# Altium project HDT_9.PrjPcb
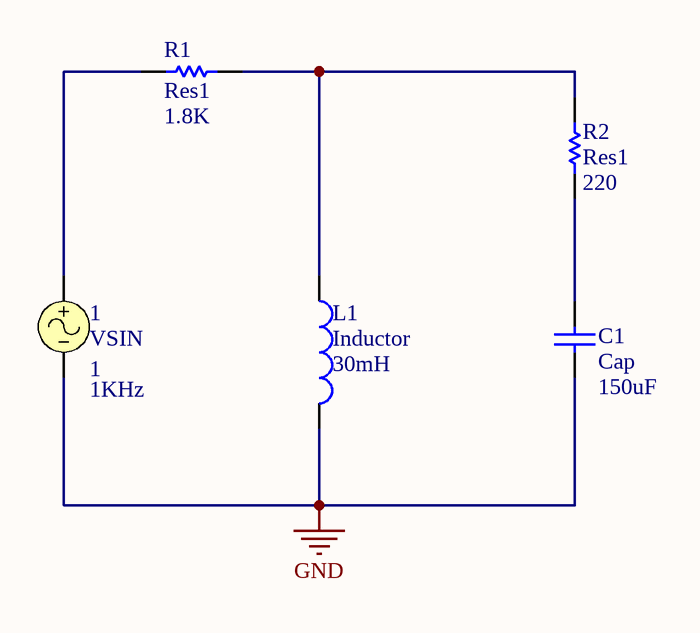
[diagram p0: Fourier.SchDoc]
6 sheets, 28 parts. Net scope: global (net labels, ports and power ports of the same name join across sheets).
Sheets:
  Fourier.SchDoc
  Montecarlo.SchDoc
  Ruido.SchDoc
  Polos y Ceros.SchDoc
  Worst case.SchDoc
  Barrido de temperatura.SchDoc

## Sheet Fourier.SchDoc
size A4

### Parts
1  VSIN  Amplitude: 1  Frequency: 1KHz
C1  Cap  value 150uF  [RAD-0.3]
L1  Inductor  value 30mH  [0402-A]
R1  Res1  value 1.8K  [AXIAL-0.3]
R2  Res1  value 220  [AXIAL-0.3]

### Nets
GND: 1.2 C1.1 L1.2
Net1_1: 1.1 R1.1
NetC1_2: C1.2 R2.2
NetL1_1: L1.1 R1.2 R2.1

### Library data of the parts
1 = VSIN: Sinusoidal Voltage Source; Note: PCB Footprint - Not required; Published: 8-Jun-2000; LatestRevisionDate: 15-Nov-2004; LatestRevisionNote: Corrected Netlist.; PackageReference: Not Applicable; Publisher: Altium Limited
C1 = Cap: Capacitor; Published: 8-Jun-2000; LatestRevisionDate: 17-Jul-2002; LatestRevisionNote: Re-released for DXP Platform.; PackageReference: RAD-0.3; Publisher: Altium Limited; PackageDescription: Radial Cap, Thru-Hole; 2 Leads; 0.3 in Pin Spacing
L1 = Inductor: Code_IEC: 1005; Published: 8-Jun-2000; LatestRevisionDate: 29-May-2009; LatestRevisionNote: IPC-7351 Footprint Added.; PackageReference: 0402-A; Publisher: Altium Limited; PackageDescription: Chip Inductor; Code_JEITA: 0402
R1 R2 = Res1: Resistor; Published: 8-Jun-2000; LatestRevisionDate: 17-Jul-2002; LatestRevisionNote: Re-released for DXP Platform.; PackageReference: AXIAL-0.3; Publisher: Altium Limited; PackageDescription: Axial Device, Thru-Hole; 2 Leads; 0.3 in Pin Spacing

## Sheet Montecarlo.SchDoc
size A4
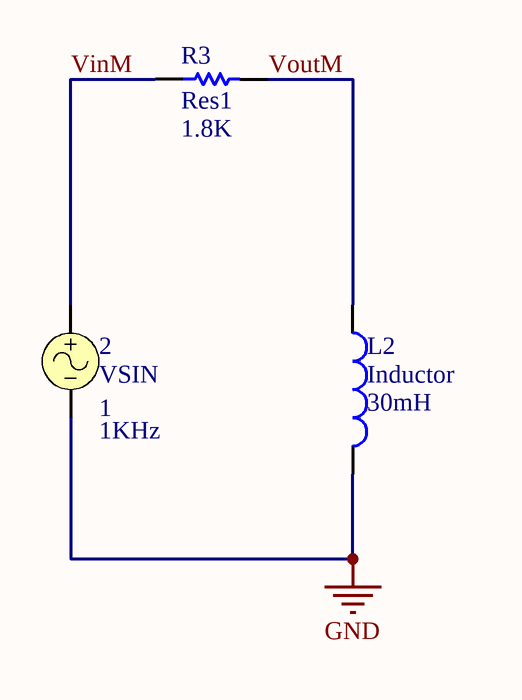
[diagram p1: Montecarlo.SchDoc]

### Parts
2  VSIN  Amplitude: 1  Frequency: 1KHz
L2  Inductor  value 30mH  [0402-A]
R3  Res1  value 1.8K  [AXIAL-0.3]

### Nets
GND: 2.2 L2.2
VinM: 2.1 R3.1
VoutM: L2.1 R3.2

### Library data of the parts
2 = VSIN: as 1 on sheet Fourier; Published: 8-Jun-2000; LatestRevisionDate: 15-Nov-2004; LatestRevisionNote: Corrected Netlist.; PackageReference: Not Applicable; Publisher: Altium Limited
L2 = Inductor: Code_IEC: 1005; Published: 8-Jun-2000; LatestRevisionDate: 29-May-2009; LatestRevisionNote: IPC-7351 Footprint Added.; PackageReference: 0402-A; Publisher: Altium Limited; PackageDescription: Chip Inductor; Code_JEITA: 0402
R3 = Res1: Resistor; Published: 8-Jun-2000; LatestRevisionDate: 17-Jul-2002; LatestRevisionNote: Re-released for DXP Platform.; PackageReference: AXIAL-0.3; Publisher: Altium Limited; PackageDescription: Axial Device, Thru-Hole; 2 Leads; 0.3 in Pin Spacing

## Sheet Ruido.SchDoc
size A4
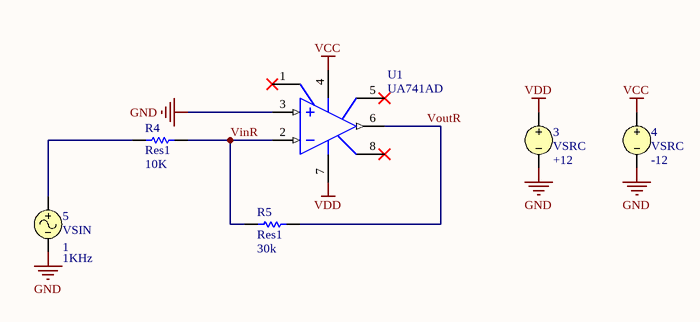
[diagram p2: Ruido.SchDoc]

### Parts
3  VSRC  value +12
4  VSRC  value -12
5  VSIN  Amplitude: 1  Frequency: 1KHz
R4  Res1  value 10K  [AXIAL-0.3]
R5  Res1  value 30k  [AXIAL-0.3]
U1  UA741AD  [SO8_L]

### Nets
GND: 3.2 4.2 5.2 U1.3(IN+)
VCC: 4.1 U1.4(V-)
VDD: 3.1 U1.7(V+)
VinR: R4.2 R5.1 U1.2(IN-)
VoutR: R5.2 U1.6(OUT)
Net5_1: 5.1 R4.1

Not connected (* = marked no-connect by the designer): U1 1(OS_NULL)* 5(OS_NULL)* 8(NC)*

### Library data of the parts
3 4 = VSRC: Voltage Source; Note: PCB Footprint - Not required; Published: 8-Jun-2000; LatestRevisionDate: 17-Jul-2002; LatestRevisionNote: Re-released for DXP Platform.; PackageReference: Not Applicable; Publisher: Altium Limited
5 = VSIN: as 1 on sheet Fourier; Published: 8-Jun-2000; LatestRevisionDate: 15-Nov-2004; LatestRevisionNote: Corrected Netlist.; PackageReference: Not Applicable; Publisher: Altium Limited
R4 R5 = Res1: Resistor; Published: 8-Jun-2000; LatestRevisionDate: 17-Jul-2002; LatestRevisionNote: Re-released for DXP Platform.; PackageReference: AXIAL-0.3; Publisher: Altium Limited; PackageDescription: Axial Device, Thru-Hole; 2 Leads; 0.3 in Pin Spacing
U1 = UA741AD: General-Purpose Single Operational Amplifier; Published: 24-Aug-2001; LatestRevisionDate: 13-Apr-2006; LatestRevisionNote: IPC-7351 Footprint Added.; DatasheetVersion: Oct-1997; PackageVersion: Dec-2002; PackageReference: SO8; Publisher: Altium Limited; PackageDescription: 8-Pin Small Outline Integrated Circuit 1.27 mm Pitch; Code_JEDEC: MS-012-AA; Code_IPC: SOIC127P600-8; ComponentLink1Description: Manufacturer Link; ComponentLink1URL: http://www.st.com/; ComponentLink2Description: Datasheet; ComponentLink2URL: http://www.st.com/stonline/products/literature/ds/5304/ua741.pdf

## Sheet Polos y Ceros.SchDoc
size A4
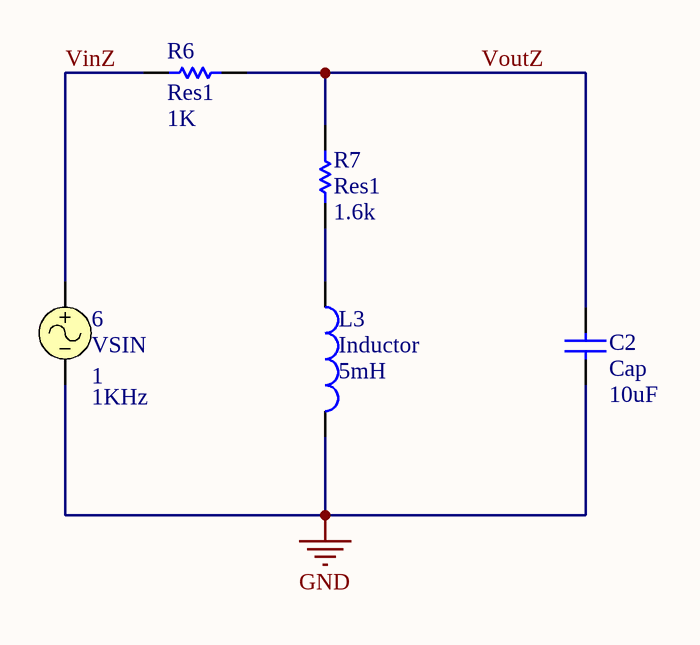
[diagram p3: Polos y Ceros.SchDoc]

### Parts
6  VSIN  Amplitude: 1  Frequency: 1KHz
C2  Cap  value 10uF  [RAD-0.3]
L3  Inductor  value 5mH  [0402-A]
R6  Res1  value 1K  [AXIAL-0.3]
R7  Res1  value 1.6k  [AXIAL-0.3]

### Nets
GND: 6.2 C2.1 L3.2
VinZ: 6.1 R6.1
VoutZ: C2.2 R6.2 R7.1
NetL3_1: L3.1 R7.2

### Library data of the parts
6 = VSIN: as 1 on sheet Fourier; Published: 8-Jun-2000; LatestRevisionDate: 15-Nov-2004; LatestRevisionNote: Corrected Netlist.; PackageReference: Not Applicable; Publisher: Altium Limited
C2 = Cap: Capacitor; Published: 8-Jun-2000; LatestRevisionDate: 17-Jul-2002; LatestRevisionNote: Re-released for DXP Platform.; PackageReference: RAD-0.3; Publisher: Altium Limited; PackageDescription: Radial Cap, Thru-Hole; 2 Leads; 0.3 in Pin Spacing
L3 = Inductor: Code_IEC: 1005; Published: 8-Jun-2000; LatestRevisionDate: 29-May-2009; LatestRevisionNote: IPC-7351 Footprint Added.; PackageReference: 0402-A; Publisher: Altium Limited; PackageDescription: Chip Inductor; Code_JEITA: 0402
R6 R7 = Res1: Resistor; Published: 8-Jun-2000; LatestRevisionDate: 17-Jul-2002; LatestRevisionNote: Re-released for DXP Platform.; PackageReference: AXIAL-0.3; Publisher: Altium Limited; PackageDescription: Axial Device, Thru-Hole; 2 Leads; 0.3 in Pin Spacing

## Sheet Worst case.SchDoc
size A4
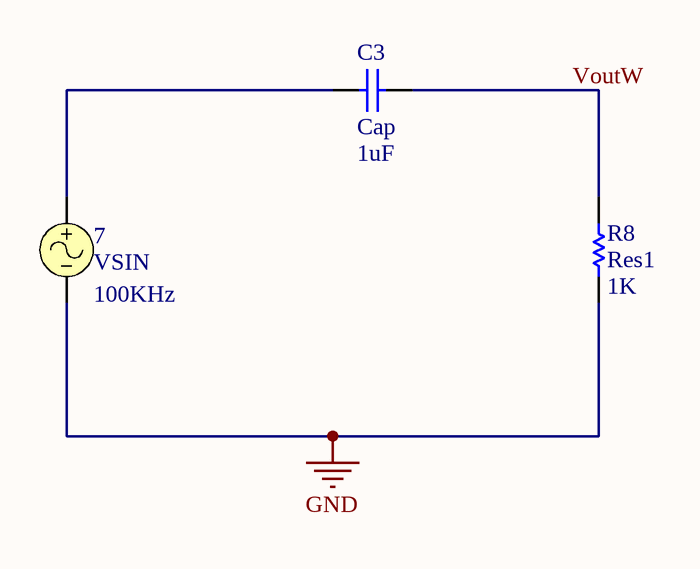
[diagram p4: Worst case.SchDoc]

### Parts
7  VSIN  Frequency: 100KHz
C3  Cap  value 1uF  [RAD-0.3]
R8  Res1  value 1K  [AXIAL-0.3]

### Nets
GND: 7.2 R8.1
VoutW: C3.2 R8.2
Net7_1: 7.1 C3.1

### Library data of the parts
7 = VSIN: as 1 on sheet Fourier; Published: 8-Jun-2000; LatestRevisionDate: 15-Nov-2004; LatestRevisionNote: Corrected Netlist.; PackageReference: Not Applicable; Publisher: Altium Limited
C3 = Cap: Capacitor; Published: 8-Jun-2000; LatestRevisionDate: 17-Jul-2002; LatestRevisionNote: Re-released for DXP Platform.; PackageReference: RAD-0.3; Publisher: Altium Limited; PackageDescription: Radial Cap, Thru-Hole; 2 Leads; 0.3 in Pin Spacing
R8 = Res1: Resistor; Published: 8-Jun-2000; LatestRevisionDate: 17-Jul-2002; LatestRevisionNote: Re-released for DXP Platform.; PackageReference: AXIAL-0.3; Publisher: Altium Limited; PackageDescription: Axial Device, Thru-Hole; 2 Leads; 0.3 in Pin Spacing

## Sheet Barrido de temperatura.SchDoc
size A4
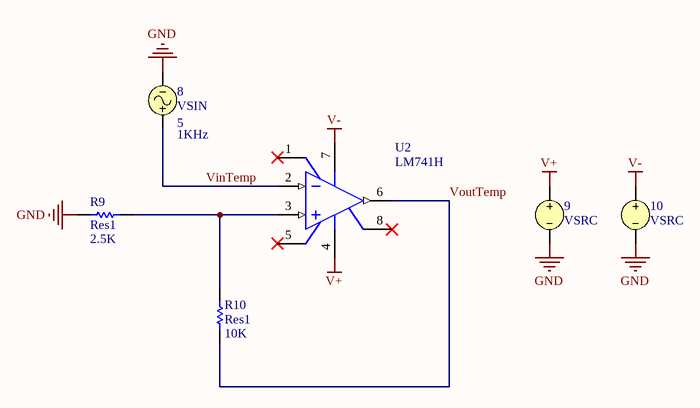
[diagram p5: Barrido de temperatura.SchDoc]

### Parts
8  VSIN  Amplitude: 5  Frequency: 1KHz
9  VSRC
10  VSRC
R9  Res1  value 2.5K  [AXIAL-0.3]
R10  Res1  value 10K  [AXIAL-0.3]
U2  LM741H  [H08C]

### Nets
GND: 8.2 9.2 10.2 R9.1
V+: 9.1 U2.4(V-)
V-: 10.1 U2.7(V+)
VinTemp: 8.1 U2.2(IN-)
VoutTemp: R10.2 U2.6(OUT)
NetR9_2: R9.2 R10.1 U2.3(IN+)

Not connected (* = marked no-connect by the designer): U2 1(OFS_NULL)* 5(OFS_NULL)* 8(NC)*

### Library data of the parts
8 = VSIN: as 1 on sheet Fourier; Published: 8-Jun-2000; LatestRevisionDate: 15-Nov-2004; LatestRevisionNote: Corrected Netlist.; PackageReference: Not Applicable; Publisher: Altium Limited
9 = VSRC: Voltage Source; Note: PCB Footprint - Not required; Value: +12; Published: 8-Jun-2000; LatestRevisionDate: 17-Jul-2002; LatestRevisionNote: Re-released for DXP Platform.; PackageReference: Not Applicable; Publisher: Altium Limited
10 = VSRC: Voltage Source; Note: PCB Footprint - Not required; Value: -12; Published: 8-Jun-2000; LatestRevisionDate: 17-Jul-2002; LatestRevisionNote: Re-released for DXP Platform.; PackageReference: Not Applicable; Publisher: Altium Limited
R9 R10 = Res1: Resistor; Published: 8-Jun-2000; LatestRevisionDate: 17-Jul-2002; LatestRevisionNote: Re-released for DXP Platform.; PackageReference: AXIAL-0.3; Publisher: Altium Limited; PackageDescription: Axial Device, Thru-Hole; 2 Leads; 0.3 in Pin Spacing
U2 = LM741H: Operational Amplifier, 8-pin TO-99; Manufacturer: National Semiconductor; PackageTopMarking: NSZXYTTE# LM741H; PowerWise: N; CompType: Amplifiers; High-Reliability: Y; Published: 4-Dec-2008; LatestRevisionDate: 13-Jan-2009; LatestRevisionNote: Sim Model Added.; DatasheetVersion: Aug-2000; PackageVersion: revF, Jun-1995; PackageReference: H08C; Publisher: Altium Limited; PackageDescription: Metal Can, TO-99, 8 Lead, .200 Dia., P.C.; Supplier 1: Farnell; Supplier Part Number 1: 1216155; PartNumber: LM741H; RoHS: N; PinCount: 8; Code_JEDEC: TO-99; ComponentLink1Description: LM741 Datasheet; ComponentLink1URL: http://www.national.com/ds/LM/LM741.pdf; ComponentLink2Description: LM741 Web Page; ComponentLink2URL: http://www.national.com/pf/LM/LM741.html; ComponentLink3Description: H08C Package Page; ComponentLink3URL: http://www.national.com/packaging/folders/h08c.html

## Nets that join several sheets
GND: Fourier (1.2 C1.1 L1.2), Montecarlo (2.2 L2.2), Ruido (3.2 4.2 5.2 U1.3), Polos y Ceros (6.2 C2.1 L3.2), Worst case (7.2 R8.1), Barrido de temperatura (8.2 9.2 10.2 R9.1)